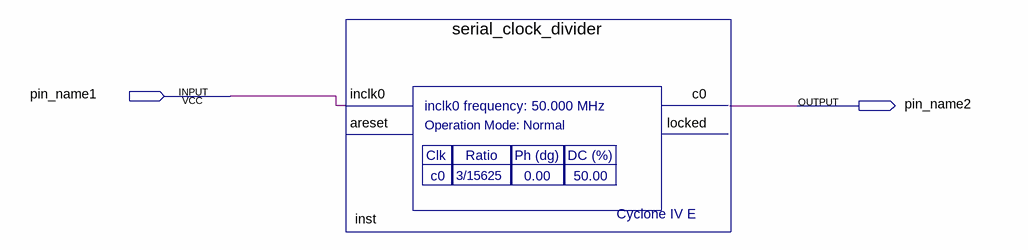
[diagram p0: schematic sheet]
// Quartus schematic basic_pll.bdf as structural Verilog: 1 symbols, 2 pins
module basic_pll (
  input  pin_name1,
  output pin_name2
);

  serial_clock_divider inst (.inclk0(pin_name1), .c0(pin_name2));  // open: areset, locked
endmodule
